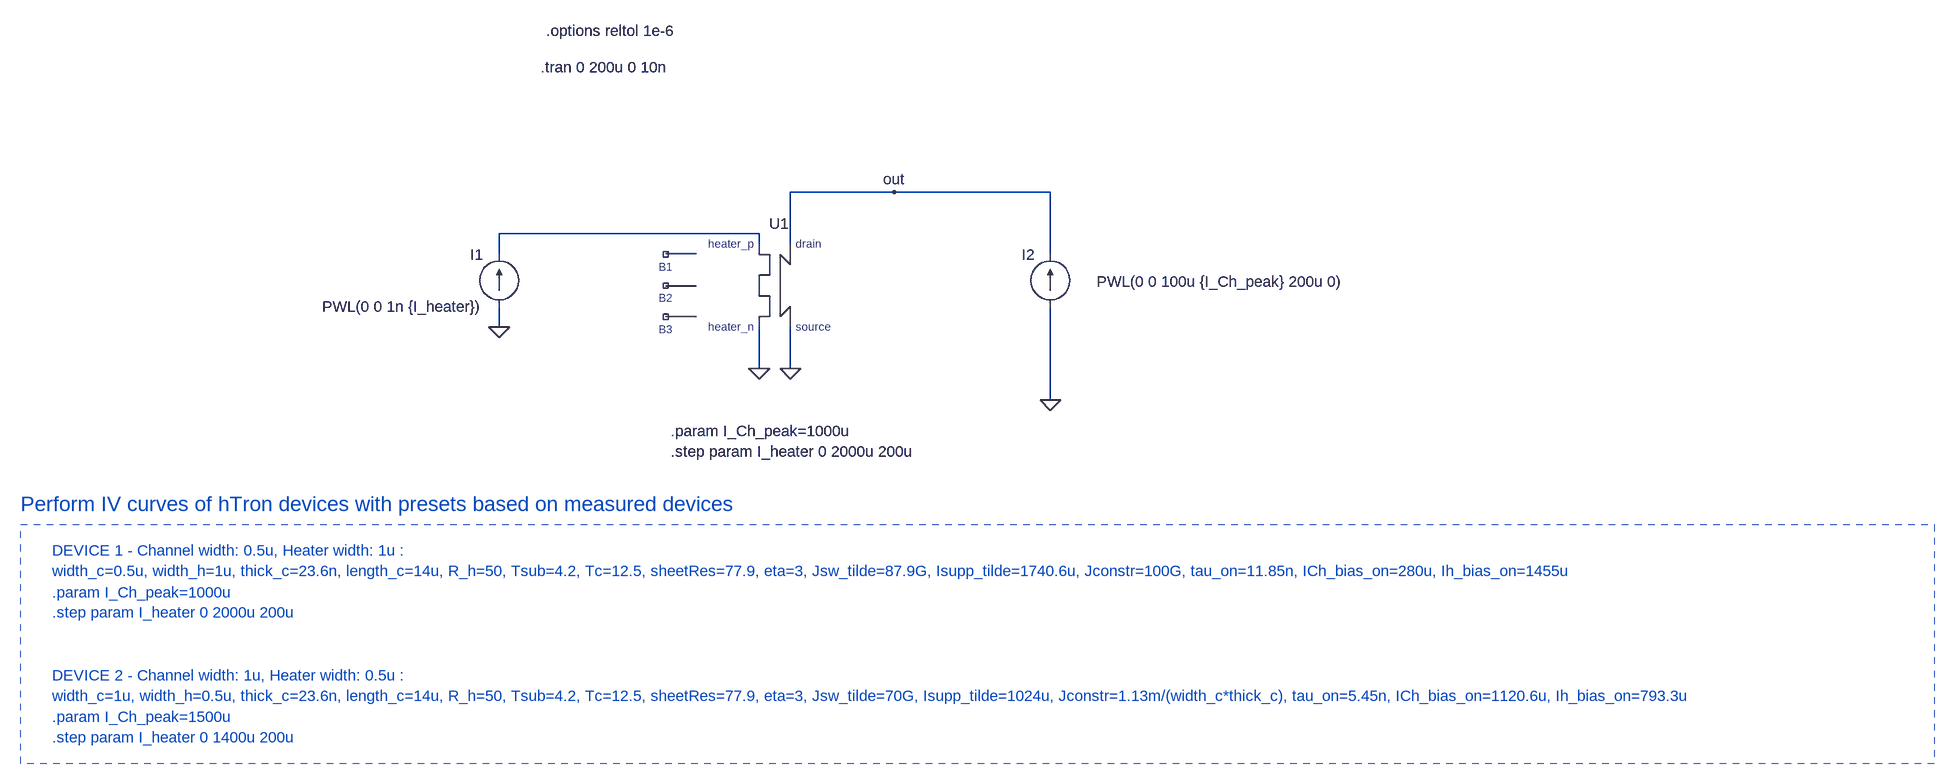
[diagram p0: schematic test_circuit.asc]
test_circuit.asc, the LTspice schematic file:
Version 4.1
SHEET 1 1964 1228
WIRE 336 32 176 32
WIRE 576 32 336 32
WIRE 128 96 -272 96
WIRE 128 112 128 96
WIRE 176 112 176 32
WIRE -272 128 -272 96
WIRE 576 128 576 32
WIRE -272 240 -272 208
WIRE 128 304 128 240
WIRE 176 304 176 240
WIRE 576 352 576 208
FLAG -272 240 0
FLAG 176 304 0
FLAG 576 352 0
FLAG 336 32 out
FLAG 128 304 0
SYMBOL current -272 208 R180
WINDOW 0 24 80 Left 2
WINDOW 3 24 0 Left 2
WINDOW 123 0 0 Left 0
WINDOW 39 0 0 Left 0
SYMATTR InstName I1
SYMATTR Value PWL(0 0 1n {I_heater})
SYMBOL current 576 208 R180
WINDOW 0 24 80 Left 2
WINDOW 3 -455 38 Left 2
WINDOW 123 0 0 Left 0
WINDOW 39 0 0 Left 0
SYMATTR InstName I2
SYMATTR Value PWL(0 0 100u {I_Ch_peak} 200u 0)
SYMBOL hTron_behavioral 192 176 R0
WINDOW 39 -22 -176 Bottom 2
SYMATTR SpiceLine ""
SYMATTR InstName U1
TEXT -8 400 Left 2 !.param I_Ch_peak=1000u\n.step param I_heater 0 2000u 200u
TEXT -208 -160 Left 2 !.tran 0 200u 0 10n
TEXT -200 -216 Left 2 !.options reltol 1e-6
TEXT -960 584 Left 2 ;DEVICE 1 - Channel width: 0.5u, Heater width: 1u :\nwidth_c=0.5u, width_h=1u, thick_c=23.6n, length_c=14u, R_h=50, Tsub=4.2, Tc=12.5, sheetRes=77.9, eta=3, Jsw_tilde=87.9G, Isupp_tilde=1740.6u, Jconstr=100G, tau_on=11.85n, ICh_bias_on=280u, Ih_bias_on=1455u
TEXT -960 776 Left 2 ;DEVICE 2 - Channel width: 1u, Heater width: 0.5u :\nwidth_c=1u, width_h=0.5u, thick_c=23.6n, length_c=14u, R_h=50, Tsub=4.2, Tc=12.5, sheetRes=77.9, eta=3, Jsw_tilde=70G, Isupp_tilde=1024u, Jconstr=1.13m/(width_c*thick_c), tau_on=5.45n, ICh_bias_on=1120.6u, Ih_bias_on=793.3u
TEXT -1008 512 Left 3 ;Perform IV curves of hTron devices with presets based on measured devices
TEXT -960 840 Left 2 ;.param I_Ch_peak=1500u\n.step param I_heater 0 1400u 200u
TEXT -960 648 Left 2 ;.param I_Ch_peak=1000u\n.step param I_heater 0 2000u 200u
RECTANGLE Normal 1936 912 -1008 544 2

The netlist it stands for:
* test_circuit.asc
I1 0 N001 PWL(0 0 1n {I_heater})
I2 0 out PWL(0 0 100u {I_Ch_peak} 200u 0)
X§U1 N001 0 out 0 NC_01 NC_02 NC_03 hTron_behav  ; pins heater_p heater_n drain source B1 B2 B3
.param I_Ch_peak=1000u
.step param I_heater 0 2000u 200u
.tran 0 200u 0 10n
.options reltol 1e-6
* DEVICE 1 - Channel width: 0.5u, Heater width: 1u :
* width_c=0.5u, width_h=1u, thick_c=23.6n, length_c=14u, R_h=50, Tsub=4.2, Tc=12.5, sheetRes=77.9, eta=3, Jsw_tilde=87.9G, Isupp_tilde=1740.6u, Jconstr=100G, tau_on=11.85n, ICh_bias_on=280u, Ih_bias_on=1455u
* DEVICE 2 - Channel width: 1u, Heater width: 0.5u :
* width_c=1u, width_h=0.5u, thick_c=23.6n, length_c=14u, R_h=50, Tsub=4.2, Tc=12.5, sheetRes=77.9, eta=3, Jsw_tilde=70G, Isupp_tilde=1024u, Jconstr=1.13m/(width_c*thick_c), tau_on=5.45n, ICh_bias_on=1120.6u, Ih_bias_on=793.3u
* Perform IV curves of hTron devices with presets based on measured devices
* .param I_Ch_peak=1500u
* .step param I_heater 0 1400u 200u
* .param I_Ch_peak=1000u
* .step param I_heater 0 2000u 200u
.lib hTron_behavioral.lib
.backanno
.end